# Altium schematic sheet Input_channel.SchDoc: Phaser
size 420 x 297 mm; EDA_Number: ARTIQ; Projet: Sampler; Author: G.Kasprowicz; CompanyName: WUT ISE; DrawnBy: G.Kasprowicz; Organization: WUT ISE; Address1: PW ISE; Address2: Nowowiejska 15/19 00-665 Warsaw; Address3: gkasprow@gmail.com; Revision: 2; SheetNumber: -; SheetTotal: -; ModifiedBy: -; CheckedDate: -; Title2: xxx; DivGrp: WUT ISE; Designer: G.Kasprowicz; ModifiedDate: -; ProjectName: Sensor Box
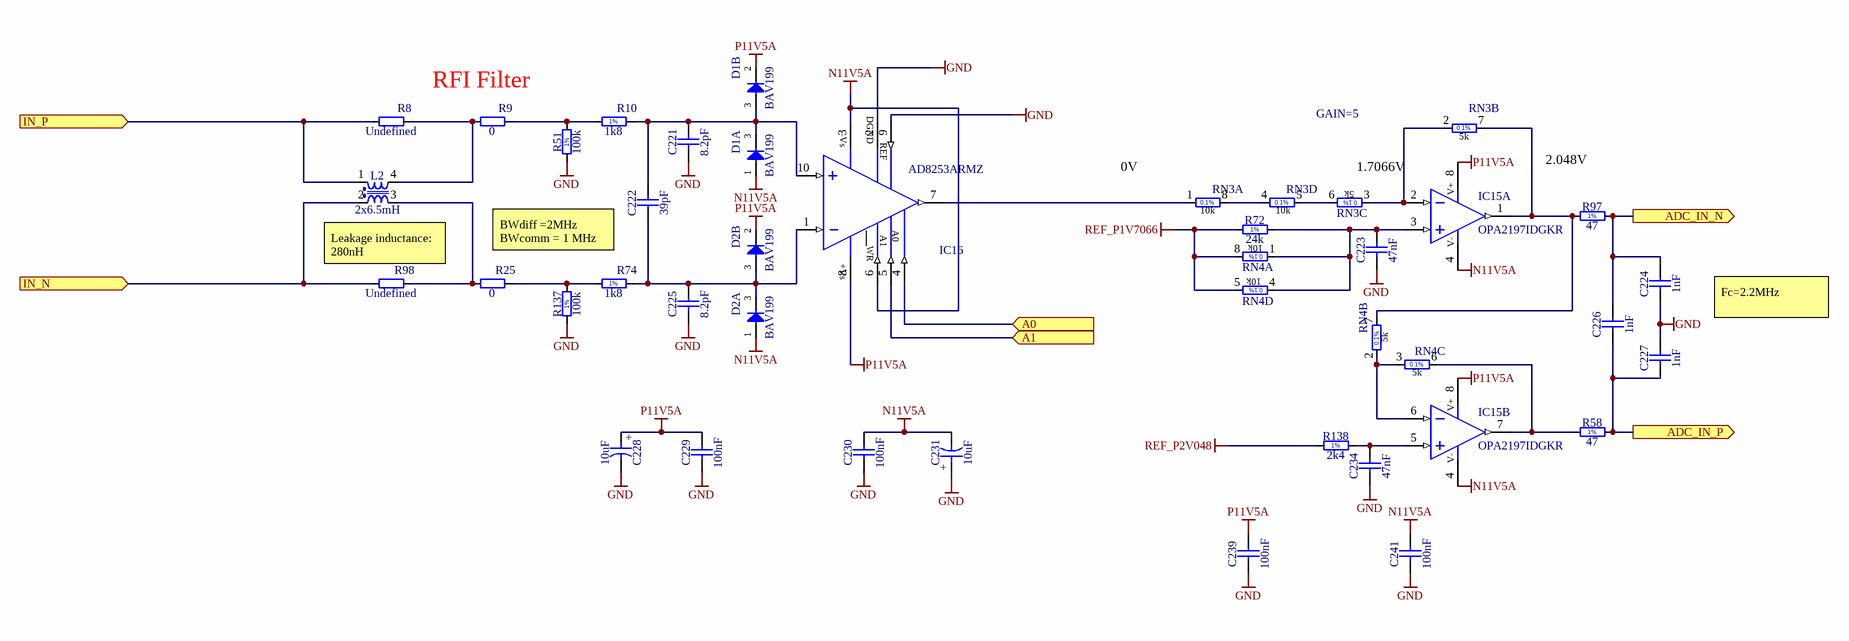
[diagram p0: Input_channel.SchDoc]

## Parts
C221  8.2pF  [CAPC1608X87N]
C222  39pF  [CAPC1608X87N]
C223  47nF  [CAPC2012X135N]
C224  1nF  [CAPC1608X90N]
C225  8.2pF  [CAPC1608X87N]
C226  1nF  [CAPC1608X90N]
C227  1nF  [CAPC1608X90N]
C228  10uF  [CAPMP3216X180N]
C229  100nF  [CAPC1005X55N]
C230  100nF  [CAPC1005X55N]
C231  10uF  [CAPMP3216X180N]
C234  47nF  [CAPC2012X135N]
C239  100nF  [CAPC1005X55N]
C241  100nF  [CAPC1005X55N]
D1  BAV199  [SOT95P240X110-3N]  (parts A,B of 2)
D2  BAV199  [SOT95P240X110-3N]  (parts A,B of 2)
IC15  OPA2197IDGKR  [SOP65P490X110-8N]  (parts A,B of 2)
IC16  AD8253ARMZ  [SOP50P490X110-10N]
L2  2x6.5mH  [IND_WURTH_WE-SL2]
R8  Undefined  [RESC1608X55N]
R9  0  [RESC1608X55N]
R10  1k8  [RESC1608X55N]
R25  0  [RESC1608X55N]
R51  100k  [RESC1608X55N]
R58  47  [RESC1005X40N]
R72  24k  [RESC1608X55N]
R74  1k8  [RESC1608X55N]
R97  47  [RESC1005X40N]
R98  Undefined  [RESC1608X55N]
R137  100k  [RESC1608X55N]
R138  2k4  [RESC1005X40N]
RN3  10k 5K 5K 10K  [SOIC127P600X175-8N]  (value not drawn)  (parts A,B,C,D of 4)
RN4  10k 5K 5K 10K  [SOIC127P600X175-8N]  (value not drawn)  (parts A,B,C,D of 4)

## Ports
A0 (in), A1 (in), ADC_IN_N (out), ADC_IN_P (out), IN_N (in), IN_P (in)

## Nets
GND: C221.1 C223.1 C224.1 C225.1 C227.2 C228.2 C229.1 C230.1 C231.1 C234.1 C239.1 C241.1 IC16.2(DGND) IC16.9(REF) R51.1 R137.1
N11V5A: C230.2 C231.2 C241.2 D1.1(A) D2.1(A) IC15.4(V-) IC16.3(-VS) IC16.6(~{WR})
P11V5A: C228.1 C229.2 C239.2 D1.2(C) D2.2(C) IC15.8(V+) IC16.8(+VS)
REF_P1V7066: R72.1 RN4.5 RN4.8
REF_P2V048: R138.1
A0: IC16.4(A0) ; port A0
A1: IC16.5(A1) ; port A1
ADC_IN_N: C224.2 C226.2 R97.2 ; port ADC_IN_N
ADC_IN_P: C226.1 C227.1 R58.2 ; port ADC_IN_P
IN_N: L2.2 R98.1 ; port IN_N
IN_P: L2.1 R8.1 ; port IN_P
NetC221_2: C221.2 C222.2 D1.3(COMAC) IC16.10(+IN) R10.2
NetC222_1: C222.1 C225.2 D2.3(COMAC) IC16.1(-IN) R74.2
NetC223_2: C223.2 IC15.3(IN+) R72.2 RN4.1 RN4.4
NetC234_2: C234.2 IC15.5(IN+) R138.2
NetIC15_1: IC15.1(OUT) R97.1 RN3.7 RN4.7
NetIC15_2: IC15.2(IN-) RN3.2 RN3.3
NetIC15_6: IC15.6(IN-) RN4.2 RN4.3
NetIC15_7: IC15.7(OUT) R58.1 RN4.6
NetIC16_7: IC16.7(OUT) RN3.1
NetL2_3: L2.3 R25.1 R98.2
NetL2_4: L2.4 R8.2 R9.1
NetR9_2: R9.2 R10.1 R51.2
NetR25_2: R25.2 R74.1 R137.2
NetRN3_4: RN3.4 RN3.8
NetRN3_5: RN3.5 RN3.6

## Notes on the sheet
- RFI Filter
- GAIN=5
- 0V
- 1.7066V
- 2.048V
- Leakage inductance: 280nH
- BWdiff =2MHz
  BWcomm = 1 MHz
- Fc=2.2MHz
- Project/Equipment
- Document
- Designer
- Drawn by
- Check.by
- Copyright WUT ISE 2018.
  This documentation describes Open Hardware and is licensed under the CERN OHL v.1.1. You may redistribute and modify this documentation under the terms of the CERN OHL v.1.1. (http://ohwr.org/CERNOHL). This documentation is distributed WITHOUT ANY EXPRESS OR IMPLIED WARRANTY, INCLUDING OF MERCHANTABILITY, SATISFACTORY QUALITY AND FITNESS FOR A PARTICULAR PURPOSE. Please see the CERN OHL v.1.1 for applicable conditions.
- Contact
- File
- Last Mod.
- Print Date
- Sheet
- Size
- A3
- of
- Rev
- (in symbol AD8253ARMZ) -Vs; WR; +Vs
- (in symbol CTE3216-18_10UF_16V_20%_AVX_TCJ) +
- (in symbol R0402_2K4_1%_0.0625W_100PPM) 1%
- (in symbol R0402_47R_1%_0.0625W_100PPM) 1%
- (in symbol R0603_1K8_1%_0.1W_100PPM) 1%
- (in symbol R0603_24K_1%_0.1W_100PPM) 1%
- (in symbol R0603_100K_1%_0.1W_100PPM) 1%
- (in symbol RN_10K_5K_VISHAY_AORN2-1AT3, part A) 10k
- (in symbol RN_10K_5K_VISHAY_AORN2-1AT3, part B) 5k
- (in symbol RN_10K_5K_VISHAY_AORN2-1AT3, part C) 5k
- (in symbol RN_10K_5K_VISHAY_AORN2-1AT3, part D) 10k

## Library data of the parts
C221 C225 = CC0603_8.2PF_50V_0.5PF_NP0: Non-polarised capacitor; Part Description: SMD Multilayer Chip Ceramic Capacitor; Manufacturer: GENERIC; Manufacturer1 Part Number: 223886715828; Voltage: 50V; TC: C0G/NP0; Tolerance: ±0.5pF; Part Number: CC0603_8.2PF_50V_0.5PF_NP0; Component Kind: Standard; Component Type: Standard; Pin Count: 2; Value: 8.2pF; Status: Preferred; Manufacturer Part Number: CC0603_8.2PF_50V_0.5PF_NP0; Case: 0603; Mounted: Yes; Socket: No; SMD: Yes; Sense: No; Manufacturer1 Example: PHYCOMP; Manufacturer1 ComponentHeight: 0.87mm; HelpURL: \\cern.ch\dfs\Applications\Altium\Datasheets\CC0603_NP0_PHYCOMP.pdf; Author: CERN DEM JLC; CreateDate: 03.12.2007; LatestRevisionDate: 03.12.2007
C222 = CC0603_39PF_50V_5%_NP0: Non-polarised capacitor; Part Description: SMD Multilayer Chip Ceramic Capacitor; Manufacturer: GENERIC; Manufacturer1 Part Number: 223886715399; Voltage: 50V; TC: C0G/NP0; Tolerance: ±5%; Part Number: CC0603_39PF_50V_5%_NP0; Component Kind: Standard; Component Type: Standard; Pin Count: 2; Value: 39pF; Status: Preferred; Manufacturer Part Number: CC0603_39PF_50V_5%_NP0; Case: 0603; Mounted: Yes; Socket: No; SMD: Yes; Sense: No; HelpURL: \\cern.ch\dfs\Applications\Altium\Datasheets\CC0603_NP0_PHYCOMP.pdf; Author: CERN DEM JLC; CreateDate: 03.12.2007; LatestRevisionDate: 03.12.2007; Manufacturer1 Example: PHYCOMP; Manufacturer1 ComponentHeight: 0.87mm
C223 C234 = CC0805_47NF_25V_5%_C0G: Non-polarised capacitor; Part Description: SMD Multilayer Chip Ceramic Capacitor; Manufacturer: GENERIC; Manufacturer1 Part Number: C0805C473J3GACTU; Voltage: 25V; TC: C0G/NP0; Tolerance: ±5%; Part Number: CC0805_47NF_25V_5%_C0G; Component Kind: Standard; Component Type: Standard; Pin Count: 2; Value: 47nF; Status: None; Manufacturer Part Number: CC0805_47NF_25V_5%_C0G; Case: 0805; Mounted: Yes; Socket: No; SMD: Yes; Sense: No; Manufacturer1 Example: KEMET; Manufacturer1 ComponentHeight: 1.4mm; HelpURL: \\cern.ch\dfs\Applications\Altium\Datasheets\CC0805_C0G_KEMET_(Commercial Grade).pdf; Author: CERN DEM JLC; CreateDate: 18.01.2011; LatestRevisionDate: 18.01.2011
C224 C226 C227 = CC0603_1NF_50V_1%_NP0: Non-polarised capacitor; Part Description: SMD Multilayer Chip Ceramic Capacitor; Manufacturer: GENERIC; Manufacturer1 Part Number: 06035A102FAT2A; Voltage: 50V; TC: C0G/NP0; Tolerance: ±1%; Part Number: CC0603_1NF_50V_1%_NP0; Component Kind: Standard; Component Type: Standard; Pin Count: 2; Value: 1nF; Status: None; Manufacturer Part Number: CC0603_1NF_50V_1%_NP0; Case: 0603; Mounted: Yes; Socket: No; SMD: Yes; Sense: No; Manufacturer1 Example: AVX; Manufacturer1 ComponentHeight: 0.9mm; HelpURL: \\cern.ch\dfs\Applications\Altium\Datasheets\CC0603_C0G_AVX.pdf; Author: CERN DEM JLC; CreateDate: 15.06.2017; LatestRevisionDate: 15.06.2017
C228 C231 = CTE3216-18_10UF_16V_20%_AVX_TCJ: Polarised capacitor; Part Description: ESR 0R200 Tantalum Solid Electrolytic Chip Capacitor with Conductive Polymer Electrode; Manufacturer: AVX; Manufacturer Part Number: TCJA106M016R0200; Voltage: 16V; Tolerance: ±20%; Part Number: CTE3216-18_10UF_16V_20%_AVX_TCJ; Component Kind: Standard; Component Type: Standard; Pin Count: 2; Value: 10uF; Status: Preferred; Case: A; Mounted: Yes; Socket: No; SMD: Yes; Sense: No; ComponentHeight: 1.8mm; HelpURL: \\cern.ch\dfs\Applications\Altium\Datasheets\CTE_AVX_TCJ.pdf; Author: CERN DEM JLC; CreateDate: 29.03.2012; LatestRevisionDate: 29.03.2012
C229 C230 C239 C241 = CC0402_100NF_16V_10%_X7R: Non-polarised capacitor; Part Description: SMD Multilayer Chip Ceramic Capacitor; Manufacturer: GENERIC; Manufacturer1 Part Number: GRM155R71C104KA88D; Voltage: 16V; TC: X7R; Tolerance: ±10%; Part Number: CC0402_100NF_16V_10%_X7R; Component Kind: Standard; Component Type: Standard; Pin Count: 2; Value: 100nF; Status: Not Recommended; Manufacturer Part Number: CC0402_100NF_16V_10%_X7R; Case: 0402; Mounted: Yes; Socket: No; SMD: Yes; Sense: No; Manufacturer1 Example: MURATA; Manufacturer1 ComponentHeight: 0.55mm; HelpURL: \\cern.ch\dfs\Applications\Altium\Datasheets\CC0402_X7R_MURATA_GRM.pdf; Author: CERN DEM JLC; CreateDate: 2013-12-05; LatestRevisionDate: 2007-12-03
D1 D2 = BAV199: Serial Diode; Part Description: Low-Leakage Double Diode; Manufacturer: NXP SEMICONDUCTORS; Voltage: 75V; Power: 250mW; PressFit: No; Bonding: No; Part Number: BAV199; Component Kind: Standard; Component Type: Standard; Device: BAV199; PackageDescription: SOT23 3-Leads, Pitch 0.95mm - Body 1.4x3mm, IPC Medium Density; Manufacturer Part Number: BAV199; Pin Count: 3; Case: SOT23-3; Mounted: Yes; Socket: No; SMD: Yes; Sense: No; ComponentHeight: 1.1mm; HelpURL: \\cern.ch\dfs\Applications\Altium\Datasheets\BAV199.pdf; Author: CERN DEM JMW; CreateDate: 2008-11-21; LatestRevisionDate: 2008-11-21
IC15 = OA_OPA2197IDGKR: 36-V, Precision, Rail-to-Rail Input Output, Low Offset Voltage Op Amp 8-VSSOP; Part Description: High-Precision, Low-Noise, Rail-to-Rail Output,10-MHz Op Amp; Manufacturer: TEXAS INSTRUMENTS; PressFit: No; Bonding: No; Part Number: OPA2197IDGKR; Component Kind: Standard; Component Type: Standard; Device: OPA2197IDGKR; PackageDescription: SOP, 0.65mm pitch; 8 pin, 3.00mm W X 3.00mm L X 1.10mm H body, IPC Medium Density; Manufacturer Part Number: OPA2197IDGKR; Pin Count: 8; Case: MSOP8; Mounted: Yes; Socket: No; SMD: Yes; Sense: No; ComponentHeight: 1.1mm; Author: GK; HelpURL: \\cern.ch\dfs\Applications\Altium\Datasheets\OPA2140AIDGK.pdf; CreateDate: 20.04.2017; LatestRevisionDate: 20.04.2017
IC16 = AD8253ARMZ: 10MHz, 20V/us, G= 1, 10, 100, 1000 iCMOS Programmable Gain Instrumentation Amplifier; Manufacturer: ANALOG DEVICES; PressFit: No; Bonding: No; Part Number: AD8253ARMZ; Component Kind: Standard; Component Type: Standard; Device: AD8253ARMZ; PackageDescription: MSOP, 10-Leads, Body 3.1x3.1mm (max), Pitch 0.50mm, IPC Medium Density; Part Description: 10MHz, 20V/us, G= 1, 10, 100, 1000 iCMOS Programmable Gain Instrumentation Amplifier; Manufacturer Part Number: AD8253ARMZ; Pin Count: 8; Case: MSOP10; Mounted: Yes; Socket: No; SMD: Yes; Sense: No; ComponentHeight: 1.1mm; Author: CERN DEM JLC; HelpURL: \\cern.ch\dfs\Applications\Altium\Datasheets\AD8253ARMZ.pdf; CreateDate: 2013-10-02; LatestRevisionDate: 2013-10-02
L2 = IND_6.5MH_50%_WURTH_WE-SL2-744229: Inductor Common Mode; Part Description: Common Mode SMD Line Filter (WE-SL2 Serie); Manufacturer: WURTH ELEKTRONIK; Manufacturer Part Number: 744229; Power: 400mA; Resistance: 0.95R; Tolerance: ±50%; Part Number: IND_6.5MH_50%_WURTH_WE-SL2-744229; Component Kind: Standard; Component Type: Standard; Pin Count: 4; Value: 2x6.5mH; Status: None; Mounted: Yes; Socket: No; SMD: Yes; Sense: No; ComponentHeight: 5.3mm; HelpURL: \\cern.ch\dfs\Applications\Altium\Datasheets\IND_WURTH_WE-SL2_744229.pdf; Author: CERN DEM JLC; CreateDate: 01.10.2012; LatestRevisionDate: 15.10.2012
R8 R98 = R0603_NO-VALUE: Resistor; Part Description: Reserved Footprint For a 0603 (1608) Chip Resistor; Mounted: No; Part Number: R0603_NO-VALUE; Component Kind: Standard; Component Type: Standard; Pin Count: 2; Value: Undefined; Status: None; Manufacturer: Undefined; Manufacturer Part Number: R0603_NO-VALUE; Case: 0603; Sense: No; Socket: No; SMD: Yes; Manufacturer1 Example: Undefined; Manufacturer1 Part Number: Undefined; Manufacturer1 ComponentHeight: Undefined; HelpURL: Undefined; Author: CERN DEM JLC; CreateDate: 03.12.2007; LatestRevisionDate: 13.03.2008
R9 R25 = R0603_0R_JUMPER: Resistor; Part Description: 1A (0.05R Max DC Resistance) Zero Ohm Jumper; Manufacturer: GENERIC; Manufacturer1 Part Number: NRC06Z0; Part Number: R0603_0R_JUMPER; Component Kind: Standard; Component Type: Standard; Pin Count: 2; Value: 0; Status: Preferred; Manufacturer Part Number: R0603_0R_JUMPER; Case: 0603; Mounted: Yes; Sense: No; Socket: No; SMD: Yes; Manufacturer1 Example: NIC COMPONENT; Manufacturer1 ComponentHeight: 0.55mm; HelpURL: \\cern.ch\dfs\Applications\Altium\Datasheets\R0603_NIC_NRC.pdf; Author: CERN DEM JLC; CreateDate: 03.12.2007; LatestRevisionDate: 13.03.2008
R10 R74 = R0603_1K8_1%_0.1W_100PPM: Resistor - 1%; Part Description: General Purpose Thick Film Chip Resistor; Manufacturer: GENERIC; Manufacturer1 Part Number: NRC06F1801TRF; Power: 0.1W; TC: ±100ppm/°C; Part Number: R0603_1K8_1%_0.1W_100PPM; Component Kind: Standard; Component Type: Standard; Pin Count: 2; Value: 1k8; Status: Preferred; Tolerance: ±1%; Manufacturer Part Number: R0603_1K8_1%_0.1W_100PPM; Case: 0603; Mounted: Yes; Sense: No; Socket: No; SMD: Yes; Manufacturer1 Example: NIC COMPONENT; Manufacturer1 ComponentHeight: 0.55mm; HelpURL: \\cern.ch\dfs\Applications\Altium\Datasheets\R0603_NIC_NRC.pdf; Author: CERN DEM JLC; CreateDate: 03.12.2007; LatestRevisionDate: 13.03.2008
R51 R137 = R0603_100K_1%_0.1W_100PPM: Resistor - 1%; Part Description: General Purpose Thick Film Chip Resistor; Manufacturer: GENERIC; Manufacturer1 Part Number: NRC06F1003TRF; Power: 0.1W; TC: ±100ppm/°C; Part Number: R0603_100K_1%_0.1W_100PPM; Component Kind: Standard; Component Type: Standard; Pin Count: 2; Value: 100k; Status: Preferred; Tolerance: ±1%; Manufacturer Part Number: R0603_100K_1%_0.1W_100PPM; Case: 0603; Mounted: Yes; Sense: No; Socket: No; SMD: Yes; Manufacturer1 Example: NIC COMPONENT; Manufacturer1 ComponentHeight: 0.55mm; HelpURL: \\cern.ch\dfs\Applications\Altium\Datasheets\R0603_NIC_NRC.pdf; Author: CERN DEM JLC; CreateDate: 03.12.2007; LatestRevisionDate: 13.03.2008
R58 R97 = R0402_47R_1%_0.0625W_100PPM: Resistor - 1%; Part Description: General Purpose Thick Film Chip Resistor; Manufacturer: GENERIC; Manufacturer1 Part Number: 232270674709L; TC: ±100ppm/°C; PressFit: No; Part Number: R0402_47R_1%_0.0625W_100PPM; Component Kind: Standard; Component Type: Standard; Pin Count: 2; Value: 47; Status: Not Recommended; Power: 0.0625W; Tolerance: ±1%; Manufacturer Part Number: R0402_47R_1%_0.0625W_100PPM; Case: 0402; Mounted: Yes; Sense: No; Socket: No; SMD: Yes; Manufacturer1 Example: YAGEO PHYCOMP; Manufacturer1 ComponentHeight: 0.4mm; HelpURL: \\cern.ch\dfs\Applications\Altium\Datasheets\R0402_Phycomp_RC0402.pdf; Author: CERN DEM JLC; CreateDate: 03.12.2007; LatestRevisionDate: 17.10.2012
R72 = R0603_24K_1%_0.1W_100PPM: Resistor - 1%; Part Description: General Purpose Thick Film Chip Resistor; Manufacturer: GENERIC; Manufacturer1 Part Number: NRC06F2402TRF; Power: 0.1W; TC: ±100ppm/°C; PressFit: No; Part Number: R0603_24K_1%_0.1W_100PPM; Component Kind: Standard; Component Type: Standard; Pin Count: 2; Value: 24k; Status: Preferred; Tolerance: ±1%; Manufacturer Part Number: R0603_24K_1%_0.1W_100PPM; Case: 0603; Mounted: Yes; Sense: No; Socket: No; SMD: Yes; Manufacturer1 Example: NIC COMPONENT; Manufacturer1 ComponentHeight: 0.55mm; HelpURL: \\cern.ch\dfs\Applications\Altium\Datasheets\R0603_NIC_NRC.pdf; Author: CERN DEM JLC; CreateDate: 03.12.2007; LatestRevisionDate: 13.03.2008
R138 = R0402_2K4_1%_0.0625W_100PPM: Resistor - 1%; Part Description: General Purpose Thick Film Chip Resistor; Manufacturer: GENERIC; Manufacturer1 Part Number: 232270672402L; TC: ±100ppm/°C; PressFit: No; Part Number: R0402_2K4_1%_0.0625W_100PPM; Component Kind: Standard; Component Type: Standard; Pin Count: 2; Value: 2k4; Status: Not Recommended; Power: 0.0625W; Tolerance: ±1%; Manufacturer Part Number: R0402_2K4_1%_0.0625W_100PPM; Case: 0402; Mounted: Yes; Sense: No; Socket: No; SMD: Yes; Manufacturer1 Example: YAGEO PHYCOMP; Manufacturer1 ComponentHeight: 0.4mm; HelpURL: \\cern.ch\dfs\Applications\Altium\Datasheets\R0402_Phycomp_RC0402.pdf; Author: CERN DEM JLC; CreateDate: 03.12.2007; LatestRevisionDate: 17.10.2012
RN3 RN4 = RN_10K_5K_VISHAY_AORN2-1AT3: DIL8 Resistor Network 4 Resistors 10k-5k-5k-10k 0.1%; Part Description: Dual-In-Line Thin Film Precision Automotive Resistors Network, (4 Isolated) - AORN Series; Manufacturer: VISHAY DALE; Power: 4x0.1W; TC: ±25ppm/°C; PressFit: No; Part Number: RN_10K_5K_VISHAY_AORN2-1AT3; Component Kind: Standard; Component Type: Standard; Pin Count: 8; Value: 10k 5K 5K 10K; Sense: No; Tolerance: 0.1%; Manufacturer Part Number: AORN2-1AT3; Case: SOIC8; Mounted: Yes; Socket: No; SMD: Yes; ComponentHeight: 1.73mm; HelpURL: \\cern.ch\dfs\Applications\Altium\Datasheets\RN_VISHAY_AORN.pdf; Author: CERN DEM JLC; CreateDate: 20.02.2017; LatestRevisionDate: 20.02.2017